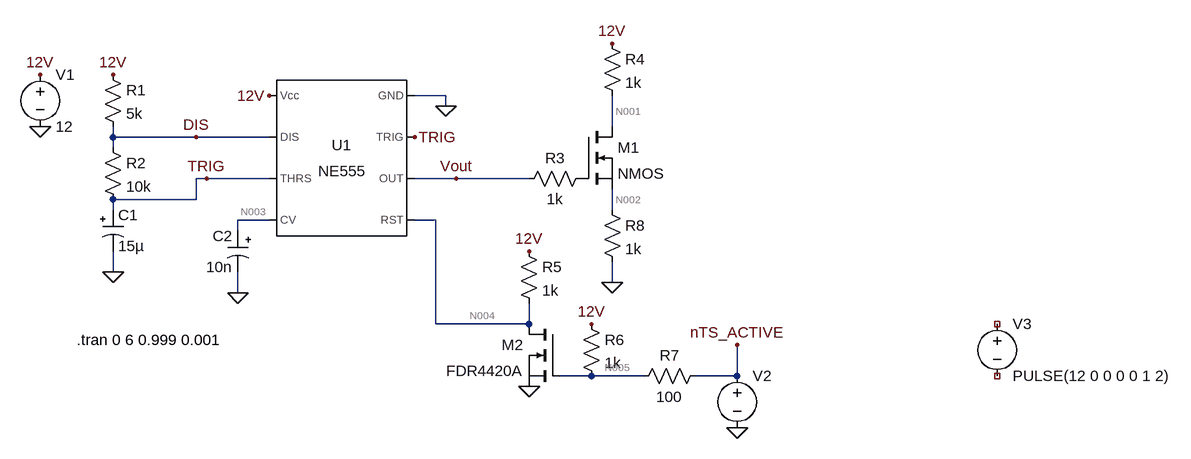
[diagram p0: schematic Timer.asc]
Timer.asc, the LTspice schematic file:
Version 4
SHEET 1 1016 680
WIRE -112 128 -160 128
WIRE -112 144 -112 128
WIRE 144 176 144 128
WIRE -624 192 -624 176
WIRE -496 192 -624 192
WIRE -384 192 -496 192
WIRE -624 208 -624 192
WIRE -480 256 -496 256
WIRE -384 256 -480 256
WIRE -96 256 -160 256
WIRE 16 256 -96 256
WIRE -496 288 -496 256
WIRE -496 288 -624 288
WIRE -624 304 -624 288
WIRE 144 304 144 272
WIRE -384 320 -432 320
WIRE -128 320 -160 320
WIRE -432 336 -432 320
WIRE -624 400 -624 368
WIRE 144 416 144 384
WIRE -432 432 -432 400
WIRE -128 480 -128 320
WIRE 16 480 16 448
WIRE 16 480 -128 480
WIRE 112 560 64 560
WIRE 192 560 112 560
WIRE 336 560 336 512
WIRE 336 560 272 560
FLAG -736 176 0
FLAG -736 96 12V
FLAG -112 144 0
FLAG -624 96 12V
FLAG -624 400 0
FLAG -384 128 12V
FLAG -432 432 0
FLAG -480 256 TRIG
FLAG -496 192 DIS
FLAG -160 192 TRIG
FLAG -96 256 Vout
FLAG 144 48 12V
FLAG 144 416 0
FLAG 16 368 12V
FLAG 16 576 0
FLAG 112 480 12V
FLAG 336 640 0
FLAG 336 512 nTS_ACTIVE
SYMBOL Misc\\NE555 -272 224 M0
SYMATTR InstName U1
SYMBOL voltage -736 80 R0
WINDOW 123 0 0 Left 2
WINDOW 39 0 0 Left 2
SYMATTR InstName V1
SYMATTR Value 12
SYMBOL polcap -640 304 R0
SYMATTR InstName C1
SYMATTR Value 15µ
SYMBOL res -640 80 R0
SYMATTR InstName R1
SYMATTR Value 5k
SYMBOL polcap -416 336 M0
SYMATTR InstName C2
SYMATTR Value 10n
SYMBOL res -640 192 R0
SYMATTR InstName R2
SYMATTR Value 10k
SYMBOL res 112 240 R90
WINDOW 0 0 56 VBottom 2
WINDOW 3 32 56 VTop 2
SYMATTR InstName R3
SYMATTR Value 1k
SYMBOL nmos 96 176 R0
SYMATTR InstName M1
SYMBOL res 128 32 R0
SYMATTR InstName R4
SYMATTR Value 1k
SYMBOL nmos 64 480 M0
SYMATTR InstName M2
SYMATTR Value FDR4420A
SYMBOL res 0 352 R0
SYMATTR InstName R5
SYMATTR Value 1k
SYMBOL res 96 464 R0
SYMATTR InstName R6
SYMATTR Value 1k
SYMBOL res 288 544 R90
WINDOW 0 0 56 VBottom 2
WINDOW 3 32 56 VTop 2
SYMATTR InstName R7
SYMATTR Value 100
SYMBOL voltage 336 544 R0
WINDOW 123 0 0 Left 2
WINDOW 39 0 0 Left 2
SYMATTR InstName V2
SYMATTR Value ""
SYMBOL res 128 288 R0
SYMATTR InstName R8
SYMATTR Value 1k
SYMBOL voltage 736 464 R0
WINDOW 123 0 0 Left 2
WINDOW 39 0 0 Left 2
SYMATTR InstName V3
SYMATTR Value PULSE(12 0 0 0 0 1 2)
TEXT -680 504 Left 2 !.tran 0 6 0.999 0.001

The netlist it stands for:
* Timer.asc
XU1 0 TRIG Vout N004 N003 TRIG DIS 12V NE555  ; pins GND TRIG OUT RST CV THRS DIS Vcc
V1 12V 0 12
C1 TRIG 0 15µ
R1 12V DIS 5k
C2 N003 0 10n
R2 DIS TRIG 10k
R3 P001 Vout 1k
M1 N001 P001 N002 N002 NMOS
R4 12V N001 1k
M2 N004 N005 0 0 FDR4420A
R5 12V N004 1k
R6 12V N005 1k
R7 nTS_ACTIVE N005 100
V2 nTS_ACTIVE 0
R8 N002 0 1k
V3 NC_01 NC_02 PULSE(12 0 0 0 0 1 2)
.model NMOS NMOS
.model PMOS PMOS
.lib standard.mos
.tran 0 6 0.999 0.001
.lib NE555.sub
.backanno
.end

* Results of the author's LTspice run, read from the files saved beside the schematic
* Operating Point, zero values left out:
*   V(trig) = 12 V
*   V(n003) = 8 V
*   V(12v) = 12 V
*   V(dis) = 12 V
*   V(vout) = 12 V
*   V(n004) = 11.93 V
*   V(p001) = 12 V
*   V(n001) = 10.84 V
*   V(n002) = 1.161 V
*   V(n005) = 1.091 V
*   Id(M1) = 1.161 mA
*   Ib(M1) = -9.687 pA
*   Is(M1) = -1.161 mA
*   Id(M2) = 164.9 pA
*   Is(M2) = -164.9 pA
*   I(R8) = 1.161 mA
*   I(R7) = -10.91 mA
*   I(R6) = 10.91 mA
*   I(R5) = 65.59 µA
*   I(R4) = 1.161 mA
*   I(R2) = 24 nA
*   I(R1) = 40.01 nA
*   I(V2) = 10.91 mA
*   I(V1) = -15.95 mA
*   Ix(u1:1) = -3.881 mA
*   Ix(u1:2) = 12 nA
*   Ix(u1:4) = 65.59 µA
*   Ix(u1:6) = 12 nA
*   Ix(u1:7) = 16.01 nA
*   Ix(u1:8) = 3.815 mA
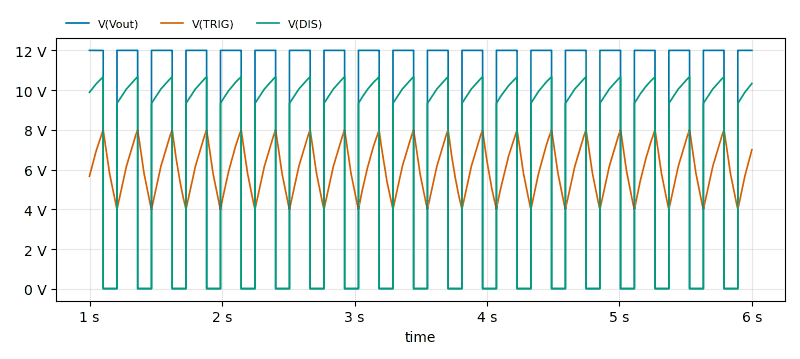
[diagram p1: Transient Analysis of Timer.asc, plotted from the saved traces]
* Transient Analysis, 1 run:
*   V(Vout): min 72 µV, max 12 V, average 7.242 V, rms 9.322 V, last 12 V
*   V(TRIG): min 3.999 V, max 8.001 V, average 6.042 V, rms 6.192 V, last 6.999 V
*   V(DIS): min 16.77 mV, max 10.67 V, average 6.081 V, rms 7.827 V, last 10.33 V